# Altium schematic sheet PRIMERPROYECTO.SchDoc
size A4; SheetNumber: 1; SheetTotal: 1
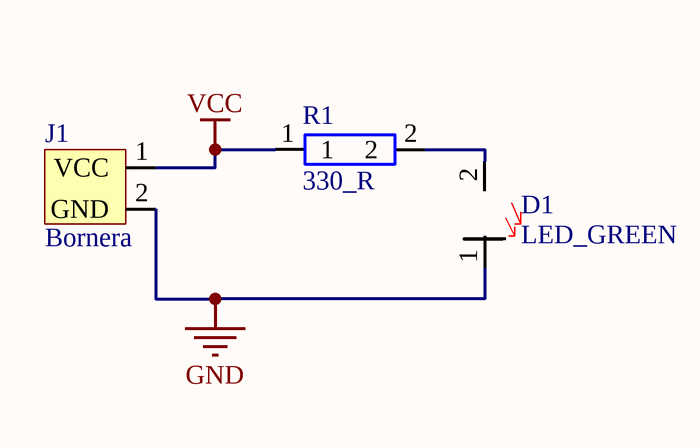
[diagram p0: PRIMERPROYECTO.SchDoc]

## Parts
D1  LED_GREEN  [LED_GREEN]
J1  Bornera  [Bornera_azul_2pines]
R1  330_R  [330R_0.25W]

## Nets
GND: D1.1(C) J1.2(GND)
VCC: J1.1(VCC) R1.1
NetD1_2: D1.2(A) R1.2

## Library data of the parts
J1 = Bornera_azul_2pines
R1 = 330R_0.25W